# Altium schematic sheet Backplane_Connector.SchDoc
size A4
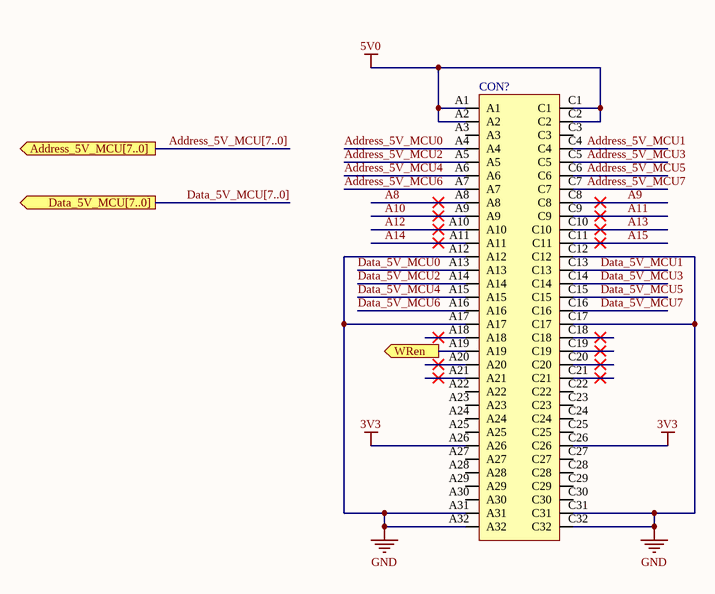
[diagram p0: Backplane_Connector.SchDoc]

## Parts
CON?  103-40034  [CON_064_THT_2MM54_M]  (value not drawn)

## Ports
Address_5V_MCU[7..0] (out), Data_5V_MCU[7..0] (out), WRen (out)

## Nets
3V3: CON?.A26 CON?.C26
5V0: CON?.A1 CON?.A2 CON?.C1 CON?.C2
GND: CON?.A12 CON?.A17 CON?.A31 CON?.A32 CON?.C12 CON?.C17 CON?.C31 CON?.C32
A8: CON?.A8
A9: CON?.C8
A10: CON?.A9
A11: CON?.C9
A12: CON?.A10
A13: CON?.C10
A14: CON?.A11
A15: CON?.C11
Address_5V_MCU0: CON?.A4
Address_5V_MCU1: CON?.C4
Address_5V_MCU2: CON?.A5
Address_5V_MCU3: CON?.C5
Address_5V_MCU4: CON?.A6
Address_5V_MCU5: CON?.C6
Address_5V_MCU6: CON?.A7
Address_5V_MCU7: CON?.C7
Data_5V_MCU0: CON?.A13
Data_5V_MCU1: CON?.C13
Data_5V_MCU2: CON?.A14
Data_5V_MCU3: CON?.C14
Data_5V_MCU4: CON?.A15
Data_5V_MCU5: CON?.C15
Data_5V_MCU6: CON?.A16
Data_5V_MCU7: CON?.C16
WRen: CON?.A19 ; port WRen

Not connected (* = marked no-connect by the designer): CON? A3 A18* A20* A21* A22 A23 A24 A25 A27 A28 A29 A30 C3 C18* C19* C20* C21* C22 C23 C24 C25 C27 C28 C29 C30

## Buses and harness runs
bus Address_5V_MCU[7..0] =  = port Address_5V_MCU[7..0]
bus Data_5V_MCU[7..0] = port Data_5V_MCU[7..0]

## Library data of the parts
CON? = CON_064_M_2MM54_L_X: C- Male Connector According to IEC 60603-2 (DIN 41612); editor_date: li_08.12.2020